# Altium schematic sheet lv_io_lim.SchDoc
size A4; Organization: Badgerloop; Address1: 133 Engineering Research; Address2: Building; Address3: Madison, WI 53715
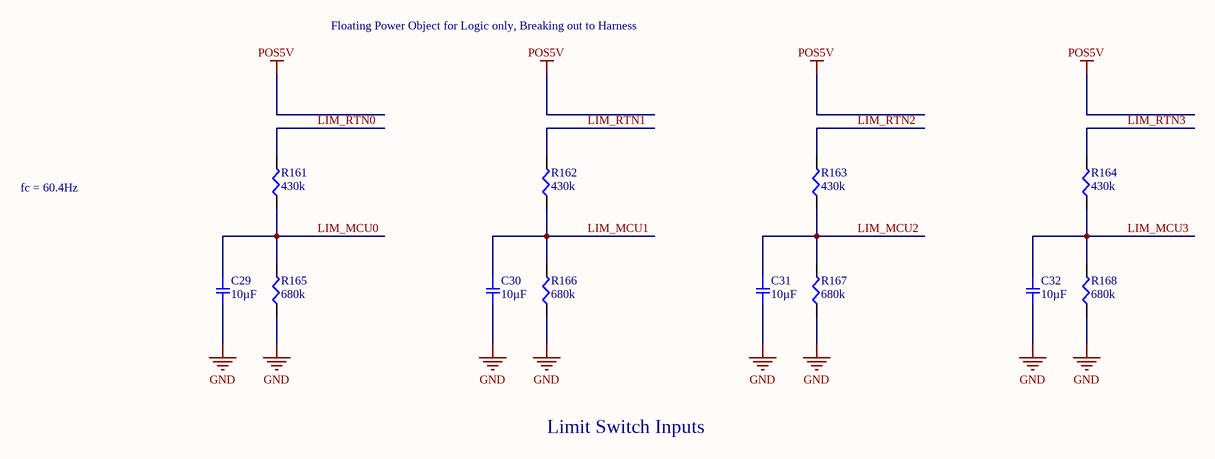
[diagram p0: lv_io_lim.SchDoc]

## Parts
C29  10µF  [SMD-0805C]
C30  10µF  [SMD-0805C]
C31  10µF  [SMD-0805C]
C32  10µF  [SMD-0805C]
R161  430k  [SMD-0402-RES]
R162  430k  [SMD-0402-RES]
R163  430k  [SMD-0402-RES]
R164  430k  [SMD-0402-RES]
R165  680k  [SMD-0402-RES]
R166  680k  [SMD-0402-RES]
R167  680k  [SMD-0402-RES]
R168  680k  [SMD-0402-RES]

## Nets
GND: C29.2 C30.2 C31.2 C32.2 R165.1 R166.1 R167.1 R168.1
LIM_MCU0: C29.1 R161.1 R165.2
LIM_MCU1: C30.1 R162.1 R166.2
LIM_MCU2: C31.1 R163.1 R167.2
LIM_MCU3: C32.1 R164.1 R168.2
LIM_RTN0: R161.2
LIM_RTN1: R162.2
LIM_RTN2: R163.2
LIM_RTN3: R164.2

## Notes on the sheet
- Floating Power Object for Logic only, Breaking out to Harness
- fc = 60.4Hz
- Limit Switch Inputs
- Title
- Size:
- Date:
- A4
- Number:
- Time:
- Revision:
- Sheet
- of
- File:

## Library data of the parts
C29-C32 = GRM21BC81E106KE51L: CAP CER 10UF 25V X6S 0805; Manufacturer: Murata Electronics North America; Factory Stock: 0; Unit Price (USD): 0.25; Minimum Quantity: 1; Tolerance: ±10%; Datasheets: http://www.murata.com/~/media/webrenewal/support/library/catalog/products/capacitor/mlcc/c02e.pdf; Image: //media.digikey.com/Renders/Murata%20Renders/0805%20(2012%20Metric)%20.85mm.jpg; Digi-Key Part Number: 490-10502-1-ND; Part Number: GRM21BC81E106KE51L; Quantity Available: 230; @ qty: 0; Packaging: Cut Tape (CT); Series: GRM; Part Status: Active; Value: 10µF; Voltage: 25V; Temperature Coefficient: X6S; Operating Temperature: -55°C ~ 105°C; Features: Derating Recommended; Ratings: -; Applications: General Purpose; Mounting Type: Surface Mount, MLCC; Package / Case: 0805 (2012 Metric); Size / Dimension: 0.079" L x 0.049" W (2.00mm x 1.25mm); Height - Seated (Max): -; Thickness (Max): 0.055" (1.40mm); Lead Spacing: -; Lead Style: -
R161-R164 = ERJ-2GEJ434X: RES SMD 430K OHM 5% 1/10W 0402; Manufacturer: Panasonic Electronic Components; Factory Stock: 0; Unit Price (USD): 0.00350; @ qty: 1500; Minimum Quantity: 1; Power (Watts): 0.1W, 1/10W; Temperature Coefficient: ±200ppm/°C; Part Number: ERJ-2GEJ434X; Datasheets: http://industrial.panasonic.com/www-cgi/jvcr13pz.cgi?E+PZ+3+AOA0001+ERJ2GEJ434X+7+WW; Image: //media.digikey.com/Photos/Panasonic%20Photos/ERJ-PA2-Series.jpg; Digi-Key Part Number: P430KJCT-ND; Quantity Available: 99138; Packaging: Cut Tape (CT); Series: ERJ; Part Status: Active; Value: 430k; Tolerance: ±5%; Composition: Thick Film; Features: Automotive AEC-Q200; Operating Temperature: -55°C ~ 155°C; Package / Case: 0402 (1005 Metric); Supplier Device Package: 0402; Size / Dimension: 0.039" L x 0.020" W (1.00mm x 0.50mm); Height - Seated (Max): 0.016" (0.40mm); Number of Terminations: 2; Failure Rate: -
R165-R168 = ERJ-2GEJ684X: RES SMD 680K OHM 5% 1/10W 0402; Manufacturer: Panasonic Electronic Components; Factory Stock: 0; Unit Price (USD): 0.00350; @ qty: 1500; Minimum Quantity: 1; Power (Watts): 0.1W, 1/10W; Temperature Coefficient: ±200ppm/°C; Part Number: ERJ-2GEJ684X; Datasheets: http://industrial.panasonic.com/www-cgi/jvcr13pz.cgi?E+PZ+3+AOA0001+ERJ2GEJ684X+7+WW; Image: //media.digikey.com/Photos/Panasonic%20Photos/ERJ-PA2-Series.jpg; Digi-Key Part Number: P680KJCT-ND; Quantity Available: 77606; Packaging: Cut Tape (CT); Series: ERJ; Part Status: Active; Value: 680k; Tolerance: ±5%; Composition: Thick Film; Features: Automotive AEC-Q200; Operating Temperature: -55°C ~ 155°C; Package / Case: 0402 (1005 Metric); Supplier Device Package: 0402; Size / Dimension: 0.039" L x 0.020" W (1.00mm x 0.50mm); Height - Seated (Max): 0.016" (0.40mm); Number of Terminations: 2; Failure Rate: -